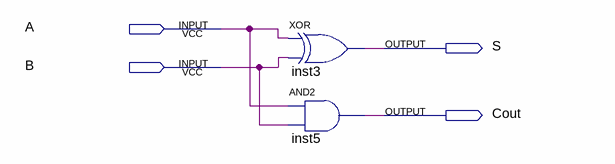
[diagram p0: schematic sheet]
// Quartus schematic half-adder.bdf as structural Verilog: 2 symbols, 4 pins
module \half-adder  (
  input  A,
  input  B,
  output S,
  output Cout
);

  xor inst3 (S, A, B);
  and inst5 (Cout, A, B);
endmodule
